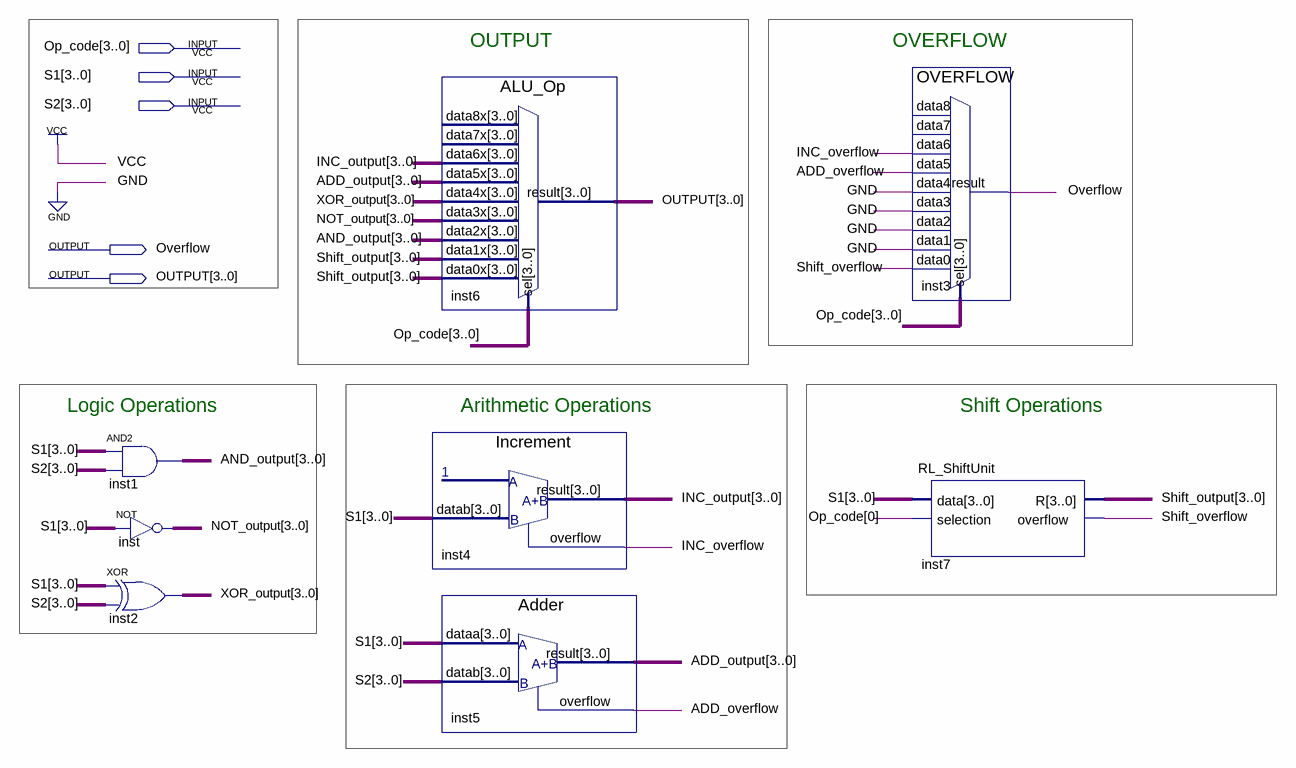
[diagram p0: schematic sheet]
// Quartus schematic Yasamin_2022510013_Group31_ALU.bdf as structural Verilog: 8 symbols, 5 pins
module Yasamin_2022510013_Group31_ALU (
  input  [3:0] Op_code,
  input  [3:0] S1,
  input  [3:0] S2,
  output Overflow,
  output [3:0] OUTPUT
);

  wire ADD_overflow, INC_overflow, Shift_overflow;
  wire [3:0] ADD_output, AND_output, INC_output, NOT_output, Shift_output, XOR_output;

  assign AND_output = S1 & S2;  // AND2 inst1, 4 bits wide
  assign NOT_output = ~S1;  // NOT inst, 4 bits wide
  assign XOR_output = S1 ^ S2;  // XOR inst2, 4 bits wide
  ALU_Op inst6 (
    .data6x(INC_output), .data5x(ADD_output), .data4x(XOR_output), .data3x(NOT_output), .data2x(AND_output),
    .data1x(Shift_output), .data0x(Shift_output), .sel(Op_code), .result(OUTPUT));  // open: data8x, data7x
  Increment inst4 (.datab(S1), .result(INC_output), .overflow(INC_overflow));
  Adder inst5 (.dataa(S1), .datab(S2), .result(ADD_output), .overflow(ADD_overflow));
  OVERFLOW inst3 (
    .data6(INC_overflow), .data5(ADD_overflow), .data4(1'b0), .data3(1'b0), .data2(1'b0), .data1(1'b0),
    .data0(Shift_overflow), .sel(Op_code), .result(Overflow));  // open: data8, data7
  RL_ShiftUnit inst7 (.data(S1), .selection(Op_code[0]), .R(Shift_output), .overflow(Shift_overflow));

  // Notes on the sheet:
  //   OUTPUT
  //   OVERFLOW
  //   Logic Operations
  //   Arithmetic Operations
  //   Shift Operations
endmodule
